# Altium schematic sheet IMX8_eMMC.SchDoc
size 594 x 420 mm; SheetNumber: 10; SheetTotal: 12
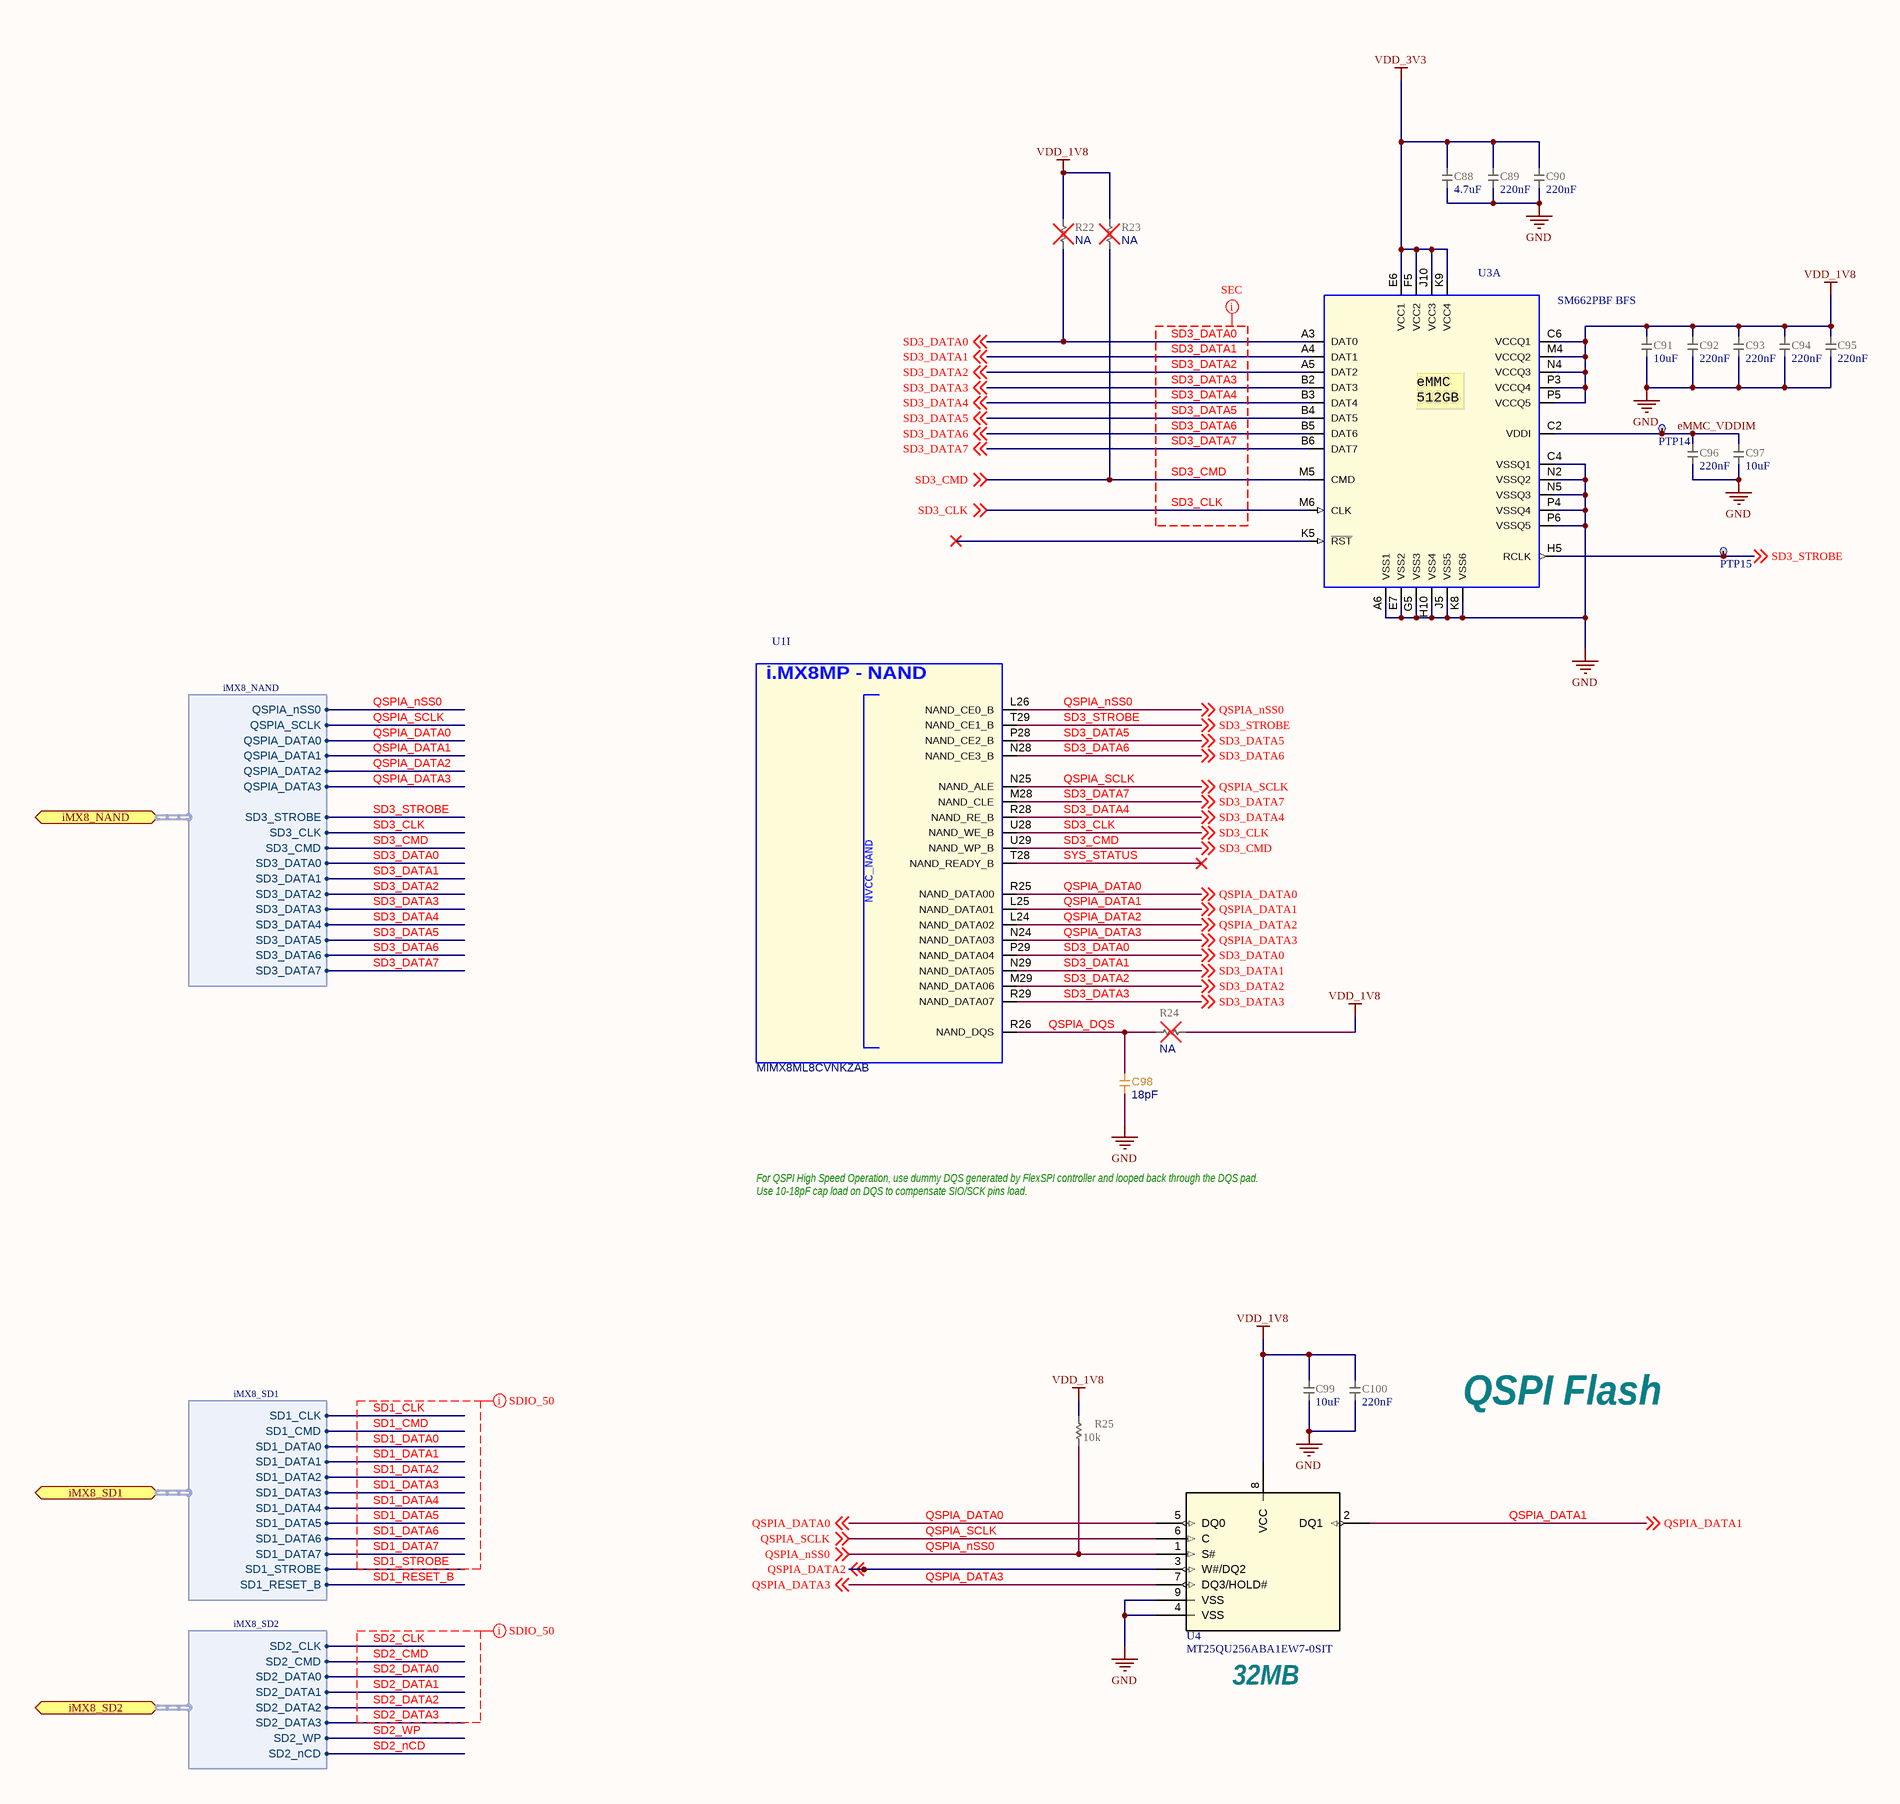
[diagram p0: IMX8_eMMC.SchDoc, left]
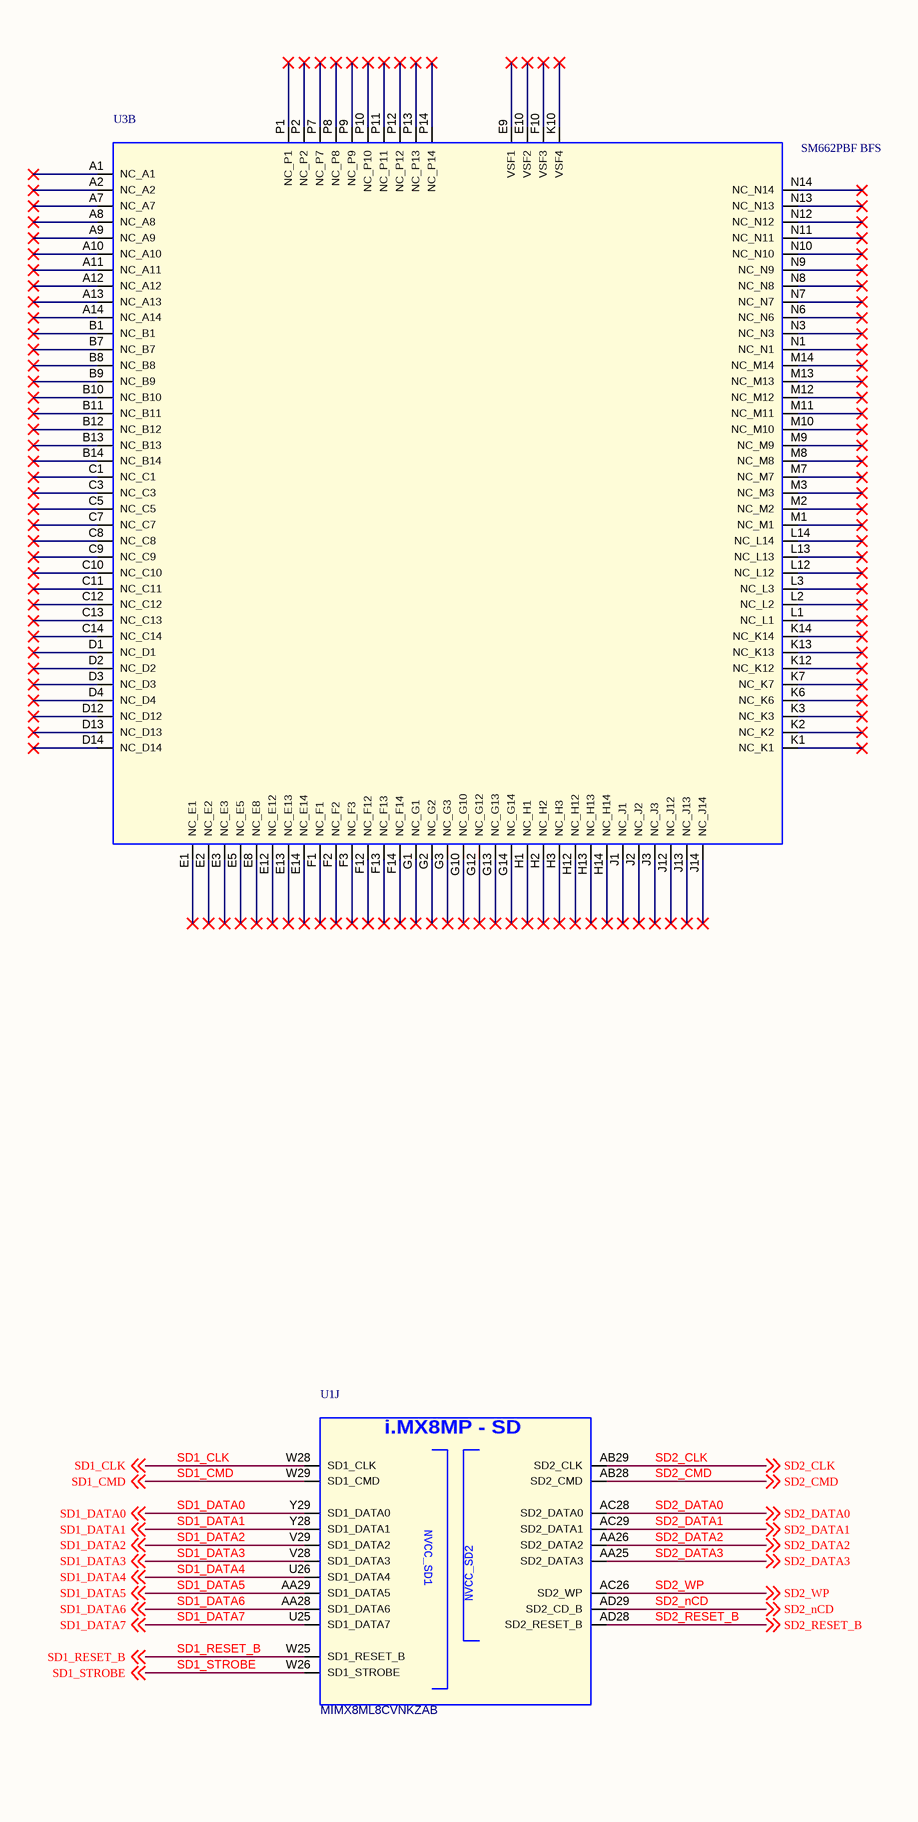
[diagram p1: IMX8_eMMC.SchDoc, right]

## Parts
C88  value 4.7uF  [CAP_0402_H09W07_UN1Q]  (hidden comment: CAP_0402_4u7_10V_X6S)
C89  value 220nF  [CAP_0201_UN1Q]  (hidden comment: CAP_0201_220n_10V_X6S)
C90  value 220nF  [CAP_0201_UN1Q]  (hidden comment: CAP_0201_220n_10V_X6S)
C91  value 10uF  [CAP_0402_H09W07_UN1Q]  (hidden comment: CAP_0402_10u_X6S)
C92  value 220nF  [CAP_0201_UN1Q]  (hidden comment: CAP_0201_220n_10V_X6S)
C93  value 220nF  [CAP_0201_UN1Q]  (hidden comment: CAP_0201_220n_10V_X6S)
C94  value 220nF  [CAP_0201_UN1Q]  (hidden comment: CAP_0201_220n_10V_X6S)
C95  value 220nF  [CAP_0201_UN1Q]  (hidden comment: CAP_0201_220n_10V_X6S)
C96  value 220nF  [CAP_0201_UN1Q]  (hidden comment: CAP_0201_220n_10V_X6S)
C97  value 10uF  [CAP_0402_H09W07_UN1Q]  (hidden comment: CAP_0402_10u_X6S)
C98  value 18pF  [CAP_0201_UN1Q]  (hidden comment: CAP_0201_18p_RF_MATCHING)
C99  value 10uF  [CAP_0402_H09W07_UN1Q]  (hidden comment: CAP_0402_10u_X6S)
C100  value 220nF  [CAP_0201_UN1Q]  (hidden comment: CAP_0201_220n_10V_X6S)
PTP14  PTP_0.4mm  [PTP_0.4mm]  (value not drawn)  (no BOM)
PTP15  PTP_0.4mm  [PTP_0.4mm]  (value not drawn)  (no BOM)
R22  value NA  [RES_0201_UN1Q]  (hidden comment: RES_0201_NA)
R23  value NA  [RES_0201_UN1Q]  (hidden comment: RES_0201_NA)
R24  value NA  [RES_0201_UN1Q]  (hidden comment: RES_0201_NA)
R25  10k  [RES_0201_UN1Q]
U1  MIMX8ML8CVNKZAB  [BGA548C50P29X29_1500X1500X148]  (parts I,J of 15)
U3  SM662PBF BFS  [GA153C50P14X14_1150X1300X120]  (parts A,B of 2)
U4  MT25QU256ABA1EW7-0SIT  [W-PDFN-8MLP8_W7_MRN]

## Ports
iMX8_NAND (bidir, harness iMX8_NAND), iMX8_SD1 (bidir, harness iMX8_SD1), iMX8_SD2 (bidir, harness iMX8_SD2)

## Harnesses
iMX8_SD1: SD1_CLK, SD1_CMD, SD1_DATA0, SD1_DATA1, SD1_DATA2, SD1_DATA3, SD1_DATA4, SD1_DATA5, SD1_DATA6, SD1_DATA7, SD1_RESET_B, SD1_STROBE
iMX8_SD2: SD2_CLK, SD2_CMD, SD2_DATA0, SD2_DATA1, SD2_DATA2, SD2_DATA3, SD2_WP, SD2_nCD
iMX8_NAND: QSPIA_SCLK, QSPIA_DATA0, QSPIA_nSS0, QSPIA_DATA1, QSPIA_DATA2, QSPIA_DATA3, SD3_STROBE, SD3_CLK, SD3_CMD, SD3_DATA0, SD3_DATA1, SD3_DATA2, SD3_DATA3, SD3_DATA4, SD3_DATA5, SD3_DATA6, SD3_DATA7

## Nets
GND: C88.1 C89.1 C90.1 C91.2 C92.1 C93.1 C94.1 C95.1 C96.1 C97.2 C98.1 C99.2 C100.2 U3.A6(VSS1) U3.C4(VSSQ1) U3.E7(VSS2) U3.G5(VSS3) U3.H10(VSS4) U3.J5(VSS5) U3.K8(VSS6) U3.N2(VSSQ2) U3.N5(VSSQ3) U3.P4(VSSQ4) U3.P6(VSSQ5) U4.4(VSS) U4.9(VSS)
VDD_1V8: C91.1 C92.2 C93.2 C94.2 C95.2 C99.1 C100.1 R22.2 R23.2 R24.2 R25.2 U3.C6(VCCQ1) U3.M4(VCCQ2) U3.N4(VCCQ3) U3.P3(VCCQ4) U3.P5(VCCQ5) U4.8(VCC)
VDD_3V3: C88.2 C89.2 C90.2 U3.E6(VCC1) U3.F5(VCC2) U3.J10(VCC3) U3.K9(VCC4)
eMMC_VDDIM: C96.2 C97.1 PTP14.1(TP) U3.C2(VDDI)
QSPIA_DATA0: U1.R25(NAND_DATA00) U4.5(DQ0) ; off-sheet QSPIA_DATA0, port iMX8_NAND.QSPIA_DATA0
QSPIA_DATA1: U1.L25(NAND_DATA01) U4.2(DQ1) ; off-sheet QSPIA_DATA1, port iMX8_NAND.QSPIA_DATA1
QSPIA_DATA2: U1.L24(NAND_DATA02) U4.3(W#/DQ2) ; off-sheet QSPIA_DATA2, port iMX8_NAND.QSPIA_DATA2
QSPIA_DATA3: U1.N24(NAND_DATA03) U4.7(DQ3/HOLD#) ; off-sheet QSPIA_DATA3, port iMX8_NAND.QSPIA_DATA3
QSPIA_DQS: C98.2 R24.1 U1.R26(NAND_DQS)
QSPIA_nSS0: R25.1 U1.L26(NAND_CE0_B) U4.1(S#) ; off-sheet QSPIA_nSS0, port iMX8_NAND.QSPIA_nSS0
QSPIA_SCLK: U1.N25(NAND_ALE) U4.6(C) ; off-sheet QSPIA_SCLK, port iMX8_NAND.QSPIA_SCLK
SD1_CLK: U1.W28(SD1_CLK) ; off-sheet SD1_CLK, port iMX8_SD1.SD1_CLK
SD1_CMD: U1.W29(SD1_CMD) ; off-sheet SD1_CMD, port iMX8_SD1.SD1_CMD
SD1_DATA0: U1.Y29(SD1_DATA0) ; off-sheet SD1_DATA0, port iMX8_SD1.SD1_DATA0
SD1_DATA1: U1.Y28(SD1_DATA1) ; off-sheet SD1_DATA1, port iMX8_SD1.SD1_DATA1
SD1_DATA2: U1.V29(SD1_DATA2) ; off-sheet SD1_DATA2, port iMX8_SD1.SD1_DATA2
SD1_DATA3: U1.V28(SD1_DATA3) ; off-sheet SD1_DATA3, port iMX8_SD1.SD1_DATA3
SD1_DATA4: U1.U26(SD1_DATA4) ; off-sheet SD1_DATA4, port iMX8_SD1.SD1_DATA4
SD1_DATA5: U1.AA29(SD1_DATA5) ; off-sheet SD1_DATA5, port iMX8_SD1.SD1_DATA5
SD1_DATA6: U1.AA28(SD1_DATA6) ; off-sheet SD1_DATA6, port iMX8_SD1.SD1_DATA6
SD1_DATA7: U1.U25(SD1_DATA7) ; off-sheet SD1_DATA7, port iMX8_SD1.SD1_DATA7
SD1_RESET_B: U1.W25(SD1_RESET_B) ; off-sheet SD1_RESET_B, port iMX8_SD1.SD1_RESET_B
SD1_STROBE: U1.W26(SD1_STROBE) ; off-sheet SD1_STROBE, port iMX8_SD1.SD1_STROBE
SD2_CLK: U1.AB29(SD2_CLK) ; off-sheet SD2_CLK, port iMX8_SD2.SD2_CLK
SD2_CMD: U1.AB28(SD2_CMD) ; off-sheet SD2_CMD, port iMX8_SD2.SD2_CMD
SD2_DATA0: U1.AC28(SD2_DATA0) ; off-sheet SD2_DATA0, port iMX8_SD2.SD2_DATA0
SD2_DATA1: U1.AC29(SD2_DATA1) ; off-sheet SD2_DATA1, port iMX8_SD2.SD2_DATA1
SD2_DATA2: U1.AA26(SD2_DATA2) ; off-sheet SD2_DATA2, port iMX8_SD2.SD2_DATA2
SD2_DATA3: U1.AA25(SD2_DATA3) ; off-sheet SD2_DATA3, port iMX8_SD2.SD2_DATA3
SD2_nCD: U1.AD29(SD2_CD_B) ; off-sheet SD2_nCD, port iMX8_SD2.SD2_nCD
SD2_RESET_B: U1.AD28(SD2_RESET_B) ; off-sheet SD2_RESET_B
SD2_WP: U1.AC26(SD2_WP) ; off-sheet SD2_WP, port iMX8_SD2.SD2_WP
SD3_CLK: U1.U28(NAND_WE_B) U3.M6(CLK) ; off-sheet SD3_CLK, port iMX8_NAND.SD3_CLK
SD3_CMD: R23.1 U1.U29(NAND_WP_B) U3.M5(CMD) ; off-sheet SD3_CMD, port iMX8_NAND.SD3_CMD
SD3_DATA0: R22.1 U1.P29(NAND_DATA04) U3.A3(DAT0) ; off-sheet SD3_DATA0, port iMX8_NAND.SD3_DATA0
SD3_DATA1: U1.N29(NAND_DATA05) U3.A4(DAT1) ; off-sheet SD3_DATA1, port iMX8_NAND.SD3_DATA1
SD3_DATA2: U1.M29(NAND_DATA06) U3.A5(DAT2) ; off-sheet SD3_DATA2, port iMX8_NAND.SD3_DATA2
SD3_DATA3: U1.R29(NAND_DATA07) U3.B2(DAT3) ; off-sheet SD3_DATA3, port iMX8_NAND.SD3_DATA3
SD3_DATA4: U1.R28(NAND_RE_B) U3.B3(DAT4) ; off-sheet SD3_DATA4, port iMX8_NAND.SD3_DATA4
SD3_DATA5: U1.P28(NAND_CE2_B) U3.B4(DAT5) ; off-sheet SD3_DATA5, port iMX8_NAND.SD3_DATA5
SD3_DATA6: U1.N28(NAND_CE3_B) U3.B5(DAT6) ; off-sheet SD3_DATA6, port iMX8_NAND.SD3_DATA6
SD3_DATA7: U1.M28(NAND_CLE) U3.B6(DAT7) ; off-sheet SD3_DATA7, port iMX8_NAND.SD3_DATA7
SD3_STROBE: PTP15.1(TP) U1.T29(NAND_CE1_B) U3.H5(RCLK) ; off-sheet SD3_STROBE, port iMX8_NAND.SD3_STROBE
SYS_STATUS: U1.T28(NAND_READY_B)

Not connected (* = marked no-connect by the designer): U3 A1(NC_A1)* A2(NC_A2)* A7(NC_A7)* A8(NC_A8)* A9(NC_A9)* A10(NC_A10)* A11(NC_A11)* A12(NC_A12)* A13(NC_A13)* A14(NC_A14)* B1(NC_B1)* B7(NC_B7)* B8(NC_B8)* B9(NC_B9)* B10(NC_B10)* B11(NC_B11)* B12(NC_B12)* B13(NC_B13)* B14(NC_B14)* C1(NC_C1)* C3(NC_C3)* C5(NC_C5)* C7(NC_C7)* C8(NC_C8)* C9(NC_C9)* C10(NC_C10)* C11(NC_C11)* C12(NC_C12)* C13(NC_C13)* C14(NC_C14)* D1(NC_D1)* D2(NC_D2)* D3(NC_D3)* D4(NC_D4)* D12(NC_D12)* D13(NC_D13)* D14(NC_D14)* E1(NC_E1)* E2(NC_E2)* E3(NC_E3)* E5(NC_E5)* E8(NC_E8)* E9(VSF1)* E10(VSF2)* E12(NC_E12)* E13(NC_E13)* E14(NC_E14)* F1(NC_F1)* F2(NC_F2)* F3(NC_F3)* F10(VSF3)* F12(NC_F12)* F13(NC_F13)* F14(NC_F14)* G1(NC_G1)* G2(NC_G2)* G3(NC_G3)* G10(NC_G10)* G12(NC_G12)* G13(NC_G13)* G14(NC_G14)* H1(NC_H1)* H2(NC_H2)* H3(NC_H3)* H12(NC_H12)* H13(NC_H13)* H14(NC_H14)* J1(NC_J1)* J2(NC_J2)* J3(NC_J3)* J12(NC_J12)* J13(NC_J13)* J14(NC_J14)* K1(NC_K1)* K2(NC_K2)* K3(NC_K3)* K5(~{RST})* K6(NC_K6)* K7(NC_K7)* K10(VSF4)* K12(NC_K12)* K13(NC_K13)* K14(NC_K14)* L1(NC_L1)* L2(NC_L2)* L3(NC_L3)* L12(NC_L12)* L13(NC_L13)* L14(NC_L14)* M1(NC_M1)* M2(NC_M2)* M3(NC_M3)* M7(NC_M7)* M8(NC_M8)* M9(NC_M9)* M10(NC_M10)* M11(NC_M11)* M12(NC_M12)* M13(NC_M13)* M14(NC_M14)* N1(NC_N1)* N3(NC_N3)* N6(NC_N6)* N7(NC_N7)* N8(NC_N8)* N9(NC_N9)* N10(NC_N10)* N11(NC_N11)* N12(NC_N12)* N13(NC_N13)* N14(NC_N14)* P1(NC_P1)* P2(NC_P2)* P7(NC_P7)* P8(NC_P8)* P9(NC_P9)* P10(NC_P10)* P11(NC_P11)* P12(NC_P12)* P13(NC_P13)* P14(NC_P14)*

## Layout directives
net class SEC: SD3_CLK, SD3_CMD, SD3_DATA0, SD3_DATA1, SD3_DATA2, SD3_DATA3, SD3_DATA4, SD3_DATA5, SD3_DATA6, SD3_DATA7
net class SDIO: SD1_CLK, SD1_CMD, SD1_DATA0, SD1_DATA1, SD1_DATA2, SD1_DATA3, SD1_DATA4, SD1_DATA5, SD1_DATA6, SD1_DATA7, SD1_STROBE, SD2_CLK, SD2_CMD, SD2_DATA0, SD2_DATA1, SD2_DATA2, SD2_DATA3

## Notes on the sheet
- For QSPI High Speed Operation, use dummy DQS generated by FlexSPI controller and looped back through the DQS pad.
  Use 10-18pF cap load on DQS to compensate SIO/SCK pins load.
- QSPI Flash
- (near U4) 32MB
- DWG NO:
- REV:
- THIS DOCUMENT AND THE DATA DISCLOSED HEREIN OR
- HEREWITH IS THE PROPERTY OF ALTIUM LIMITED AND MAY
- BE FREELY DISTRIBUTED IN WHOLE. NO RIGHTS ARE
- RESERVED OR EXPRESS OR IMPLIED WARANTEE GIVEN.
- REVISION
- DESCRIPTION
- DATE
- APPROVED
- ENG:
- APPROVALS
- PROJECT
- DSN:
- CHK:
- REFERENCE DOCUMENTS
- PROJECT REVISION:
- TITLE
- DOCUMENT REVISION:
- DESIGN ITEM:
- BOM:
- FAB DWG:
- PCB DWG:
- ASSY DWG:
- SCALE:
- A2
- SIZE
- CAGE CODE
- FILE NAME
- DWG NO.
- SHEET
- OF
- REV
- (in symbol CMP-001-000983-8, part I) i.MX8MP - NAND
- (in symbol CMP-001-000983-8, part J) i.MX8MP - SD
- (in symbol CMP-001-001175-2, part A) eMMC / 512GB

## Library data of the parts
C88 = CMP-001-000888-12: CAP; Part Number: GRT155C81A475ME13J; Manufacturer: Murata; Sort order: 304; HasBeenBuilt: TBD; Alternative component: Allowed; System: RLC; Voltage: 10V; Temperature characteristics: X6S; Tolerance: +/-10%; ComponentLink2Description: 2_Product page; Package: 0402; Creation date: 26042024; ComponentLink1Description: 1_Datasheet; ComponentLink3Description: 3_X-information; ComponentLink4Description: 4_X-information; Manufacturer Part Number: GRT155C81A475ME13J; Component Type: Capacitor
C89 C90 C92-C96 C100 = CMP-001-000889-11: CAP; Part Number: GRM033C81A224KE01D; Manufacturer: Murata; Temperature characteristics: X6S; Voltage: 10V; Tolerance: +/-20%; Sort order: 302; HasBeenBuilt: TBD; Alternative component: Allowed; System: RLC; Package: 0201; Dimensions WxLxH: 0.35; ComponentLink1Description: 1_Datasheet; ComponentLink2Description: 2_Product page; ComponentLink3Description: 3_X-information; ComponentLink4Description: 4_X-information; Creation date: 26042024; ClassName: SMALL; Manufacturer Part Number: GRM033C81A224KE01D; Component Type: Capacitor
C91 C97 C99 = CMP-001-000883-14: CAP; Part Number: GMC04X6S106M6R3NT; Manufacturer: Cal-Chip Electronics; Voltage: 6.3V; Tolerance: +/-20%; Temperature characteristics: X6S; Sort order: 304; HasBeenBuilt: TBD; Alternative component: Allowed; System: RLC; Package: 0402; ComponentLink1Description: 1_Datasheet; ComponentLink2Description: 2_Product page; ComponentLink3Description: 3_X-information; ComponentLink4Description: 4_X-information; Creation date: 26042024; Manufacturer Part Number: GMC04X6S106M6R3NT; Component Type: Capacitor
C98 = CMP-001-000400-12: CAP_RF_MATCHING; Part Number: GJM0335C1E180JB01; Manufacturer: Murata; Voltage: 25V; Tolerance: +/-2%; Temperature characteristics: C0G; Remark: RF matching, use part number; Sort order: 202; HasBeenBuilt: TBD; System: RLC; Package: 0201; ClassName: SMALL; ComponentLink1Description: 1_Datasheet; ComponentLink2Description: 2_Product page; ComponentLink3Description: 3_X-information; ComponentLink4Description: 4_X-information; Creation date: 20200101; Source: RLC_UN1Q.SchLib; Manufacturer Part Number: GJM0335C1E180JB01; Component Type: Capacitor
PTP14 PTP15 = CMP-001-001296-3: Production Testpoint 0.4mm. Flying probe. Use 1mm pitch.; Part Number: PTP 0.4mm; ComponentLink4Description: 4_X-information; ComponentLink1Description: 1_Datasheet; Sort order: -; ClassName: SMALL; System: Test Point; HasBeenBuilt: -; Design Item ID: PTP_0.4mm; ComponentLink3Description: 3_X-information; Creation date: 20240909; ComponentLink2Description: 2_Product page; Component Type: Test Point
R22-R24 = CMP-001-000434-10: Not Assembled - RES; Sort order: 999; HasBeenBuilt: TBD; System: RLC; Package: 0201; ClassName: SMALL; ComponentLink1Description: 1_Datasheet; ComponentLink2Description: 2_Product page; ComponentLink3Description: 3_X-information; ComponentLink4Description: 4_X-information; Creation date: 20190101; Source: RLC_UN1Q.SchLib; Component Type: Resistor
R25 = RES_0201_10k: RES; Tolerance: +/-1%; Desc2: resistance_10K_1%_1/20W; Power Rating: 1/20W; Sort order: 322; HasBeenBuilt: TBD; HasBeenChecked: None; System: RLC; Value: 10k; Package: 0201; ClassName: SMALL; ComponentLink1Description: 1_Datasheet; ComponentLink2Description: 2_Product_page; ComponentLink3Description: 3_X-information; ComponentLink4Description: 4_X-information; Creation date: 20190101
U1 = CMP-001-000983-8: CPU QUAD CORTEX A53+M4 1.6GHZ BGA548 Industrial; Manufacturer: NXP Semiconductors; Sort order: 501; System: IC; ComponentLink1Description: 1_Datasheet; ComponentLink1URL: https://www.nxp.com/part/MIMX8ML8CVNKZAB#/; ComponentLink2Description: 2_Product page; ComponentLink3Description: 3_X-information; ComponentLink4Description: 4_X-information; Creation date: 20240524; Dimensions WxLxH: 15 x 15 x 1.33mm; Operating temperature range: -40... +105 °C; Package: FCBGA548; Part Number: MIMX8ML8CVNKZAB; ClassName: BIG; Source: UUDET_KOMPONENTIT.SchLib; Design Item ID: MIMX8ML8CVNKZAB; Manufacturer Part Number: MIMX8ML8CVNKZAB; Component Type: Processor
U3 = CMP-001-001175-2: MEM NAND FLASH 512GB eMMC 5.1 HS400 2.7-3.6V, 1.8V VCCQ, TFBGA153 Ferri-eMMC Automotive; Manufacturer: Silicon Motion; Manufacturer Part Number: SM662PBFBFSS; Sort order: 511; System: IC; ComponentLink1Description: 1_Datasheet; ComponentLink2Description: 2_Product page; ComponentLink2URL: https://www.siliconmotion.com/products/Ferri-eMMC/detail; ComponentLink3Description: 3_Product brief; ComponentLink3URL: https://www.siliconmotion.com/download/DWo5/a/Ferri-eMMC_PB_EN.pdf; ComponentLink4Description: 4_X-information; Creation Date: 20250508; Dimensions WxLxH: 11.5 x 13 x 1.2 mm; Operating temperature range: -40 .... +105 °C; Package: TFBGA-153; Part Number: SM662PBF BFS; Component Type: Memory
U4 = MT25QU256ABA1EW7-0SIT: Description; Manufacturer_Name: Micron; Copyright: Copyright (C) 2025 Ultra Librarian. All rights reserved.; Manufacturer_Part_Number: MT25QU256ABA1EW7-0SIT; RefDes: RefDes; Type: Type